# EAGLE design smd_retail (EAGLE 5.06)
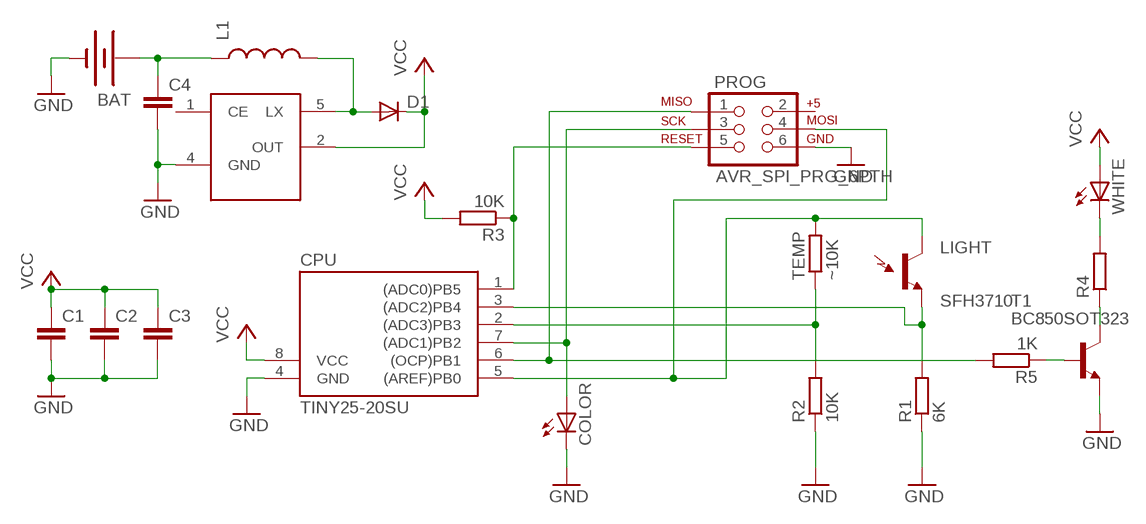
[diagram p0: schematic, sheet 1]

## Parts
BAT  BATTERY20PTH  [BATTCOM_20MM_PTH]
C1  C-EUC0805K  [C0805K]
C2  C-EUC0805K  [C0805K]
C3  C-EUC0805K  [C0805K]
C4  C-EUC0805K  [C0805K]
COLOR  LEDCHIPLED_1206  [CHIPLED_1206]
CPU  TINY25-20SU  [SOIC8]
D1  DIODESOD  [SOD-323]
L1  INDUCTORCDRH62B  [CDRH62BNP-470MC]
LIGHT  SFH3710  [SFH3710]
NCP  NCP1402  [SOT23-5]
PROG  AVR_SPI_PRG_6PTH  [2X3]
R1  6K  R-EU_R0805W  [R0805W]
R2  10K  R-EU_R0805W  [R0805W]
R3  10K  R-EU_R0805W  [R0805W]
R4  R-EU_R0805W  [R0805W]
R5  1K  R-EU_R0805W  [R0805W]
T1  BC850SOT323  [SOT323-BEC]
TEMP  ~10K  R-EU_0204/5  [0204/5]
WHITE  LEDKA-3528ASYC  [KA-3528ASYC]

## Nets
GND: BAT.2(-) C1.2 C2.2 C3.2 C4.2 COLOR.C CPU.4(GND) NCP.4(GND) PROG.6 R1.1 R2.1 T1.E
N$1: CPU.6((OCP)PB1) PROG.1 R5.2
N$2: CPU.1((ADC0)PB5) PROG.5 R3.1
N$3: CPU.5((AREF)PB0) LIGHT.P$1(C1) PROG.4 TEMP.2
N$4: CPU.2((ADC3)PB3) R2.2 TEMP.1
N$5: CPU.3((ADC2)PB4) LIGHT.P$2(E1) R1.2
N$6: COLOR.A CPU.7((ADC1)PB2) PROG.3
N$7: BAT.1(+) C4.1 L1.P$1
N$8: D1.2(A) L1.P$2 NCP.5(LX)
N$9: R5.1 T1.B
N$10: R4.1 T1.C
N$11: R4.2 WHITE.C
VCC: C1.1 C2.1 C3.1 CPU.8(VCC) D1.1(C) NCP.2(OUT) R3.2 WHITE.A
Unconnected: NCP.1(CE) PROG.2

## Library data of the parts
BAT = SparkFun:BATTERY: Battery Holders Various common sizes : AA, AAA, 20mm coin cell and 12mm coin cell.
C1-C4 = rcl:C-EU: CAPACITOR, European symbol
COLOR WHITE = led:LED: LED OSRAM: - CHIPLED LG R971, LG N971, LY N971, LG Q971, LY Q971, LO R971, LY R971 LH N974, LH R974 LS Q976, LO Q976, LY Q976 LO Q996 - Hyper CHIPLED LW Q18S LB Q993, LB Q99A, LB R99A - SideLED LS A670, LO A670, LY A670, LG A670, LP A670 LB A673, LV A673, LT A673, LW A673 LH A674 LY A675 LS A676, LA A676, LO A676, LY A676, LW A676 LS A679, LY A679, LG A679 - Hyper Micro SIDELED® LS Y876, LA Y876, LO Y876, LY Y876 LT Y87S - SmartLED LW L88C, LW L88S LB L89C, LB L89S, LG L890 LS L89K, LO L89K, LY L89K LS L896, LA L896, LO L896, LY L896 - TOPLED LS T670, LO T670, LY T670, LG T670, LP T670 LSG T670, LSP T670, LSY T670, LOP T670, LYG T670 LG T671, LOG T671, LSG T671 LB T673, LV T673, LT T673, LW T673 LH T674 LS T676, LA T676, LO T676, LY T676, LB T676, LH T676, LSB T676, LW T676 LB T67C, LV T67C, LT T67C, LS T67K, LO T67K, LY T67K, LW E67C LS E67B, LA E67B, LO E67B, LY E67B, LB E67C, LV E67C, LT E67C LW T67C LS T679, LY T679, LG T679 LS T770, LO T770, LY T770, LG T770, LP T770 LB T773, LV T773, LT T773, LW T773 LH T774 LS E675, LA E675, LY E675, LS T675 LS T776, LA T776, LO T776, LY T776, LB T776 LHGB T686 LT T68C, LB T68C - Hyper Mini TOPLED® LB M676 - Mini TOPLED Santana® LG M470 LS M47K, LO M47K, LY M47K Source: http://www.osram.convergy.de LUXEON: - LUMILED® LXK2-PW12-R00, LXK2-PW12-S00, LXK2-PW14-U00, LXK2-PW14-V00 LXK2-PM12-R00, LXK2-PM12-S00, LXK2-PM14-U00 LXK2-PE12-Q00, LXK2-PE12-R00, LXK2-PE12-S00, LXK2-PE14-T00, LXK2-PE14-U00 LXK2-PB12-K00, LXK2-PB12-L00, LXK2-PB12-M00, LXK2-PB14-N00, LXK2-PB14-P00, LXK2-PB14-Q00 LXK2-PR12-L00, LXK2-PR12-M00, LXK2-PR14-Q00, LXK2-PR14-R00 LXK2-PD12-Q00, LXK2-PD12-R00, LXK2-PD12-S00 LXK2-PH12-R00, LXK2-PH12-S00 LXK2-PL12-P00, LXK2-PL12-Q00, LXK2-PL12-R00 Source: www.luxeon.com KINGBRIGHT: KA-3528ASYC Source: www.kingbright.com
CPU = avr-2:TINY25
D1 = SparkFun:DIODE: Diode These are standard reverse protection diodes and small signal diodes. SMA package can handle up to about 1A. SOD-323 can handle about 200mA. What the SOD-323 package when ordering, there are some mfgs out there that are 5-pin packages.
L1 = additional:INDUCTOR: Inductors Basic Inductor/Choke - 0603 and 1206. Footprints are not proven and vary greatly between part numbers.
LIGHT = sfh3410:SFH3710
NCP = additional:NCP1402
PROG = SparkFun:AVR_SPI_PRG_6: AVR ISP 6 Pin This is the reduced ISP connector for AVR programming. Common on Arduino. This footprint will take up less PCB space and can be used with a 10-pin to 6-pin adapter such as SKU: BOB-08508
R1-R5 TEMP = rcl:R-EU_: RESISTOR, European symbol
T1 = additional:BC850: NPN TRANSISTOR

## Board
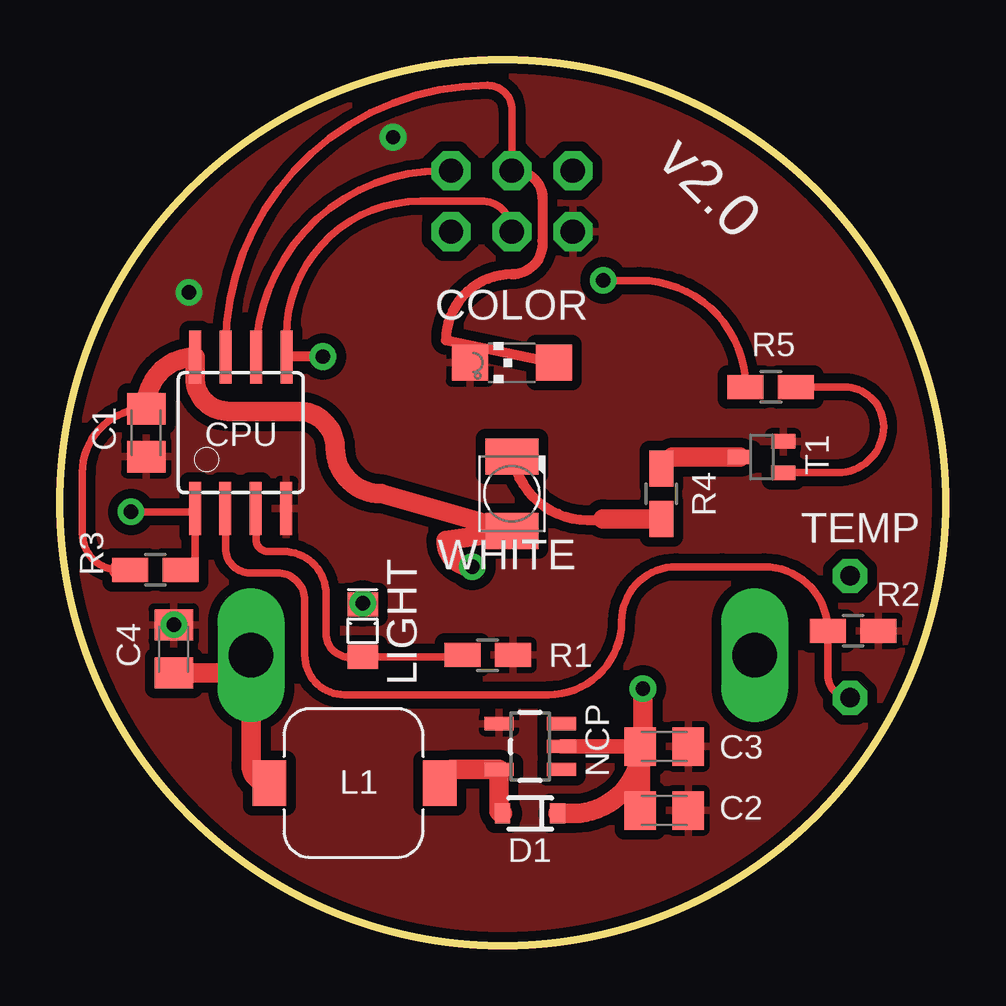
[diagram p1: board, top side]
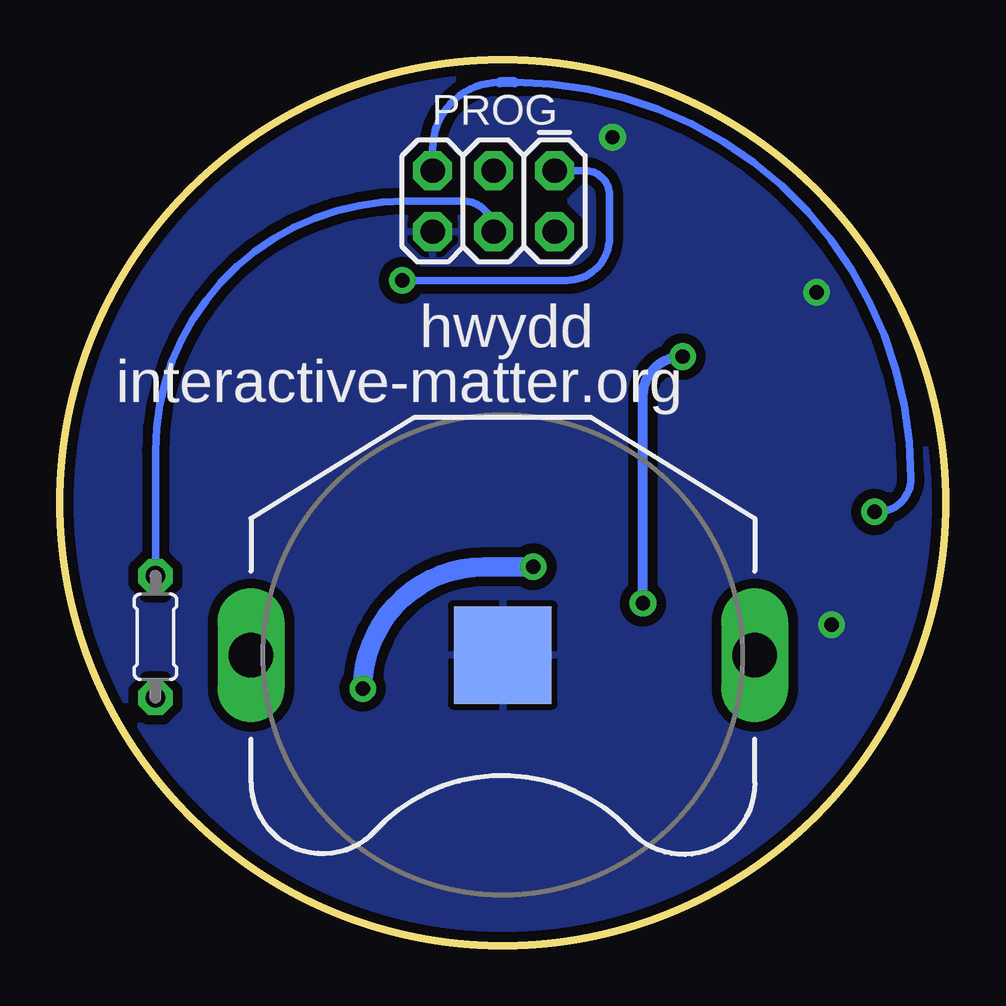
[diagram p2: board, bottom side, seen from below]

Size 36.92 x 36.92 mm. Coordinates in mm from the lower left corner, seen from the top.
Outline: circle at 18.46,18.46 radius 18.46
Copper layers (1*16): Top 0.035mm / dielectric 1.5mm / Bottom 0.035mm
Design rules "SparkFun": minimum track width 8mil, minimum drill 20mil, track to track 8mil, track to pad 8mil, pad to pad 8mil, via to via 8mil, smd to smd 0mil, copper to edge 10mil, drill to drill 8mil, minimum pad ring 12mil, minimum via ring 10mil, stop-mask expansion 4mil, vias tented up to drill 25mil, thermal gap 10mil

### Footprints (pad centres in the part's own frame; a part is rotated, then mirrored left to right if it is on the bottom)
BATTCOM_20MM_PTH = drill 1.854 long: 1 -10.5,0; 3 10.5,0 | smd 4.064 x 4.064: 2 0,0
C0805K = smd 1.3 x 1.6: 1 -1,0; 2 1,0
CHIPLED_1206 = smd 1.5 x 1.5: A 0,-1.75; C 0,1.75
SOIC8 = smd 0.5 x 2.2: 1 -1.905,-3.154; 2 -0.645,-3.154; 3 0.625,-3.154; 4 1.895,-3.154; 5 1.905,3.154; 6 0.635,3.154; 7 -0.635,3.154; 8 -1.905,3.154
SOD-323 = smd 0.63 x 0.83: 1 -1.15,0; 2 1.15,0
CDRH62BNP-470MC = smd 1.9 x 1.4: P$1 0,-3.5; P$2 0,3.6
SFH3710 = smd 1 x 1.27: P$1 -1.1,0; P$2 1.1,0
SOT23-5 = smd 0.55 x 1.2: 1 -0.95,-1.3; 2 0,-1.3; 3 0.95,-1.3; 4 0.95,1.3; 5 -0.95,1.3
2X3 = drill 1.016 octagon: 1 0,0; 2 0,2.54; 3 2.54,0; 4 2.54,2.54; 5 5.08,0; 6 5.08,2.54
R0805W = smd 1.5 x 1: 1 -1.052,0; 2 1.052,0
SOT323-BEC = smd 0.6 x 1: B -0.65,-0.9; C 0,0.9; E 0.65,-0.9
0204/5 = drill 0.813 octagon: 1 -2.54,0; 2 2.54,0
KA-3528ASYC = smd 1.5 x 2.2: A -1.55,0; C 1.55,0

### Placement (x,y rotation side)
BAT  18.46,12.11 180 bottom
C1  3.6,21.38 270 top
C2  25.19,5.63 0 top
C3  25.19,8.3 0 top
C4  4.74,12.36 90 top
COLOR  18.84,24.3 90 top
CPU  7.54,21.38 0 top
D1  19.6,5.5 180 top
L1  12.24,6.77 270 top
LIGHT  12.62,13.12 270 top
NCP  19.6,8.3 90 top
PROG  16.3,32.3 180 bottom
R1  17.82,12.11 180 top
R2  33.06,13.12 180 top
R3  3.98,15.66 180 top
R4  25.06,18.84 270 top
R5  29.63,23.28 180 top
T1  29.25,20.36 90 top
TEMP  32.94,12.87 90 bottom
WHITE  18.84,18.84 90 top

### Tracks (layer width: path | path; a pad name or v marks a point on that pad's centre or on a via)
GND  (via drill 0.6, 0.6 pad 1.02)
  other vias: 5.38,27.22 4.74,13.38 13.89,33.7
  pour Bottom (isolate 0.406): -0.46,37.38 36.87,36.87 36.87,0.04 0.04,0.04
  pour Top (isolate 0.406): -1.23,38.27 38.14,38.02 38.27,-1.35 -1.23,-1.35
N$1  (via drill 0.6)
  Top 0.305: CPU.6 arc-90 15.94,32.3 | R5.2 arc90 24.14,27.73 v22.65,27.73
  Top 0.813: 15.94,32.3 PROG.1
  Bottom 0.305: v22.65,27.73 15.79,27.73 arc-90 14.01,29.51 14.01,31.29 arc-90 15.03,32.3 PROG.1
N$2  (via drill 0.6)
  Top 0.305: CPU.1 5.63,16.26 arc-90 R3.1 | 5.48,18.08 v2.96,18.08
  Top 0.406: CPU.1 arc-90 5.48,18.08
  Bottom 0.305: PROG.5 21.38,33.19 arc90 18.59,35.98 | 17.95,35.98 arc90 1.44,19.47 arc90 2.84,18.08
  Bottom 0.406: 17.95,35.98 18.59,35.98 | v2.96,18.08 2.84,18.08
N$3  (via drill 0.6)
  Top 0.305: PROG.4 arc90 17.57,31.03 15.03,31.03 arc90 9.44,25.44
  Top 0.406: 9.44,25.44 CPU.5 arc-90 9.46,24.55 v10.97,24.55 | LIGHT.P$1 v12.62,14.27
  Bottom 0.305: TEMP.2 32.94,20.62 arc90 22.52,31.03 20.11,31.03 arc90 PROG.4
  Bottom 0.406: v12.62,14.27 12.62,22.9 arc90 v10.97,24.55
N$4
  Top 0.305: CPU.2 6.9,16.55 arc90 7.92,15.54 9.06,15.54 arc-90 10.2,14.39 10.2,12.11 arc90 11.85,10.46 20.36,10.46 arc90 23.41,13.51 arc-90 25.7,15.79 27.6,15.79 29.34,15.79 arc-90 R2.2 32.01,11.26 arc90 TEMP.1
  Top 0.406: CPU.2 arc90 CPU.2 | R2.2 32.01,13.41
N$5
  Top 0.305: 12.07,12.02 arc-90 11.09,13 11.09,14.65 arc90 9.31,16.43 8.68,16.43 arc-90 8.17,16.93 CPU.3 | LIGHT.P$2 16.69,12.02
  Top 0.406: 12.07,12.02 LIGHT.P$2 | CPU.3 arc90 CPU.3 | 16.69,12.02 arc90 R1.2
N$6
  Top 0.305: PROG.3 18.84,34.84 arc90 17.82,35.86 arc90 6.9,24.94
  Top 0.406: CPU.7 6.9,24.94 | COLOR.A 16.09,25.23 arc-90 18.84,27.98 arc95 20.11,29.38 20.11,31.16 arc90 18.97,32.3 PROG.3
N$7
  Top 0.813: C4.1 7.21,11.36 arc90 BAT.1 7.96,7.55 arc90 L1.P$1
N$8
  Top 0.813: L1.P$2 arc-90 16.41,7.35 NCP.5 18.3,5.65 arc90 D1.2
N$9
  Top 0.305: T1.B 32.41,19.71 arc90 34.33,21.63 arc90 32.68,23.28 R5.1
N$10
  Top 0.305: R4.1 arc-90 25.53,20.36
  Top 0.406: R4.1 arc90 25.21,19.74
  Top 0.813: 25.53,20.36 T1.C
N$11
  Top 0.406: WHITE.C arc90 22.64,17.79
  Top 0.813: 22.64,17.79 R4.2
VCC  (via drill 0.6)
  Top 0.305: 2.46,15.66 arc-90 0.93,17.19 0.93,19.71 arc-90 C1.1
  Top 0.61: C3.1 NCP.2
  Top 0.813: D1.1 21.4,5.5 arc90 C3.1 24.19,7.79 | 24.19,7.79 C2.1 | v17.19,15.79 arc-90 16.09,16.89 WHITE.A 13.38,18.84 arc-90 11.47,20.74 arc90 9.95,22.27 7.03,22.27 arc-90 5.63,23.67 CPU.8 arc90 3.6,22.5 C1.1 | v24.3,10.71 24.3,7.9 arc-90 24.19,7.79 | R3.2 2.46,15.66
  Bottom 0.813: v17.19,15.79 19.22,15.79 arc-90 v24.3,10.71

### Text on the board
tPlace: v2.0
bPlace: hwydd
bNames: interactive-matter.org